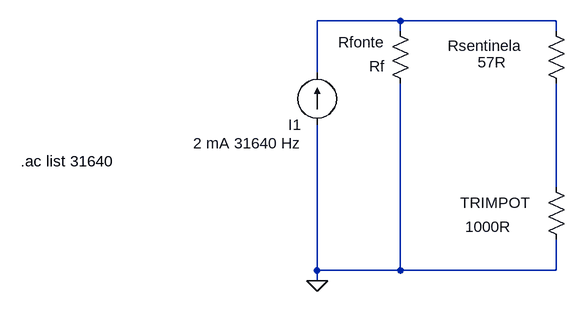
[diagram p0: schematic Esquema TRIMPOT.asc]
Esquema TRIMPOT.asc, the LTspice schematic file:
Version 4
SHEET 1 1208 680
WIRE -432 128 -560 128
WIRE -192 128 -432 128
WIRE -432 144 -432 128
WIRE -192 144 -192 128
WIRE -560 208 -560 128
WIRE -192 384 -192 224
WIRE -560 512 -560 288
WIRE -432 512 -432 224
WIRE -432 512 -560 512
WIRE -192 512 -192 464
WIRE -192 512 -432 512
WIRE -560 528 -560 512
FLAG -560 528 0
SYMBOL res -208 128 R0
WINDOW 0 -151 38 Left 2
WINDOW 3 -105 64 Left 2
SYMATTR InstName Rsentinela
SYMATTR Value 57R
SYMBOL res -448 128 R0
WINDOW 0 -80 33 Left 2
WINDOW 3 -32 70 Left 2
SYMATTR InstName Rfonte
SYMATTR Value Rf
SYMBOL current -560 288 R180
WINDOW 3 24 -28 Left 2
WINDOW 123 63 58 Left 2
WINDOW 39 0 0 Left 0
SYMATTR Value 2 mA 31640 Hz
SYMATTR InstName I1
SYMBOL res -208 368 R0
WINDOW 0 -132 40 Left 2
WINDOW 3 -124 77 Left 2
SYMATTR InstName TRIMPOT
SYMATTR Value 1000R
TEXT -1016 344 Left 2 !.ac list 31640

The netlist it stands for:
* Esquema TRIMPOT.asc
Rsentinela N001 N002 57R
Rfonte N001 0 Rf
I1 0 N001 2 mA 31640 Hz
R§TRIMPOT N002 0 1000R
.ac list 31640
.backanno
.end